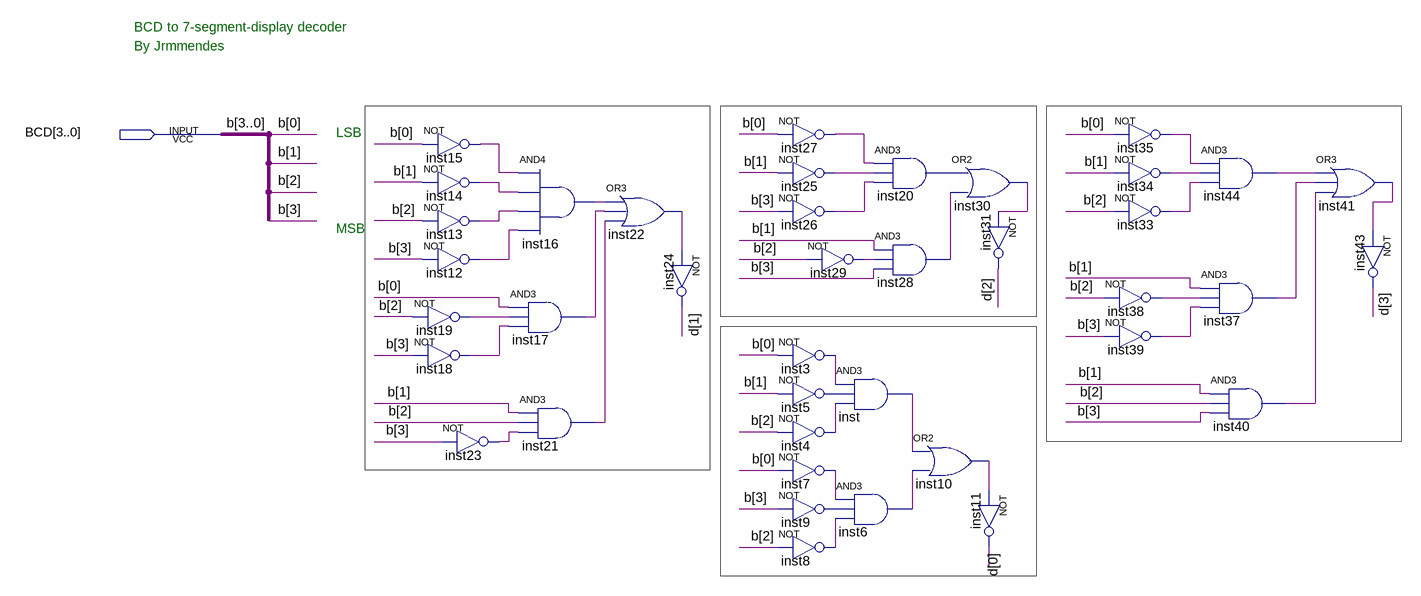
[diagram p0: schematic sheet]
// Quartus schematic bcd_to_7segd.bdf as structural Verilog: 40 symbols, 1 pins
module bcd_to_7segd (
  input  [3:0] BCD
);

  wire inst3_out, inst4_out, inst5_out, inst6_out, inst7_out, inst8_out, inst9_out, inst10_out, inst12_out,
       inst13_out, inst14_out, inst15_out, inst16_out, inst17_out, inst18_out, inst19_out, inst20_out,
       inst21_out, inst22_out, inst23_out, inst25_out, inst26_out, inst28_out, inst29_out, inst30_out,
       inst33_out, inst34_out, inst35_out, inst37_out, inst38_out, inst39_out, inst40_out, inst41_out,
       inst44_out, inst_out, undriven;
  wire [3:0] d;

  not inst15 (inst15_out, BCD[0]);
  not inst14 (inst14_out, BCD[1]);
  not inst13 (inst13_out, BCD[2]);
  not inst12 (inst12_out, BCD[3]);
  not inst19 (inst19_out, BCD[2]);
  not inst18 (inst18_out, BCD[3]);
  and inst17 (inst17_out, BCD[0], inst19_out, inst18_out);
  not inst23 (inst23_out, BCD[3]);
  and inst16 (inst16_out, inst15_out, inst14_out, inst13_out, inst12_out);
  and inst21 (inst21_out, BCD[1], BCD[2], inst23_out);
  or inst22 (inst22_out, inst16_out, inst17_out, inst21_out);
  not inst24 (d[1], inst22_out);
  not inst27 (BCD[0], undriven);
  not inst25 (inst25_out, BCD[1]);
  not inst26 (inst26_out, BCD[3]);
  not inst29 (inst29_out, BCD[2]);
  not inst3 (inst3_out, BCD[0]);
  not inst5 (inst5_out, BCD[1]);
  not inst4 (inst4_out, BCD[2]);
  not inst7 (inst7_out, BCD[0]);
  not inst9 (inst9_out, BCD[3]);
  not inst8 (inst8_out, BCD[2]);
  and inst20 (inst20_out, BCD[0], inst25_out, inst26_out);
  and inst28 (inst28_out, BCD[1], inst29_out, BCD[3]);
  and inst (inst_out, inst3_out, inst5_out, inst4_out);
  and inst6 (inst6_out, inst7_out, inst9_out, inst8_out);
  or inst30 (inst30_out, inst20_out, inst28_out);
  or inst10 (inst10_out, inst_out, inst6_out);
  not inst11 (d[0], inst10_out);
  not inst31 (d[2], inst30_out);
  not inst35 (inst35_out, BCD[0]);
  not inst34 (inst34_out, BCD[1]);
  not inst33 (inst33_out, BCD[2]);
  not inst38 (inst38_out, BCD[2]);
  not inst39 (inst39_out, BCD[3]);
  and inst44 (inst44_out, inst35_out, inst34_out, inst33_out);
  and inst37 (inst37_out, BCD[1], inst38_out, inst39_out);
  and inst40 (inst40_out, BCD[1], BCD[2], BCD[3]);
  or inst41 (inst41_out, inst44_out, inst37_out, inst40_out);
  not inst43 (d[3], inst41_out);

  // Other names for the same wires on the sheet: b[3:0] = BCD

  // Notes on the sheet:
  //   BCD to 7-segment-display decoder
  //   By Jrmmendes
  //   LSB
  //   MSB
endmodule
